# EAGLE design EC-TDS-PPM1_6 (EAGLE 7.5.0)
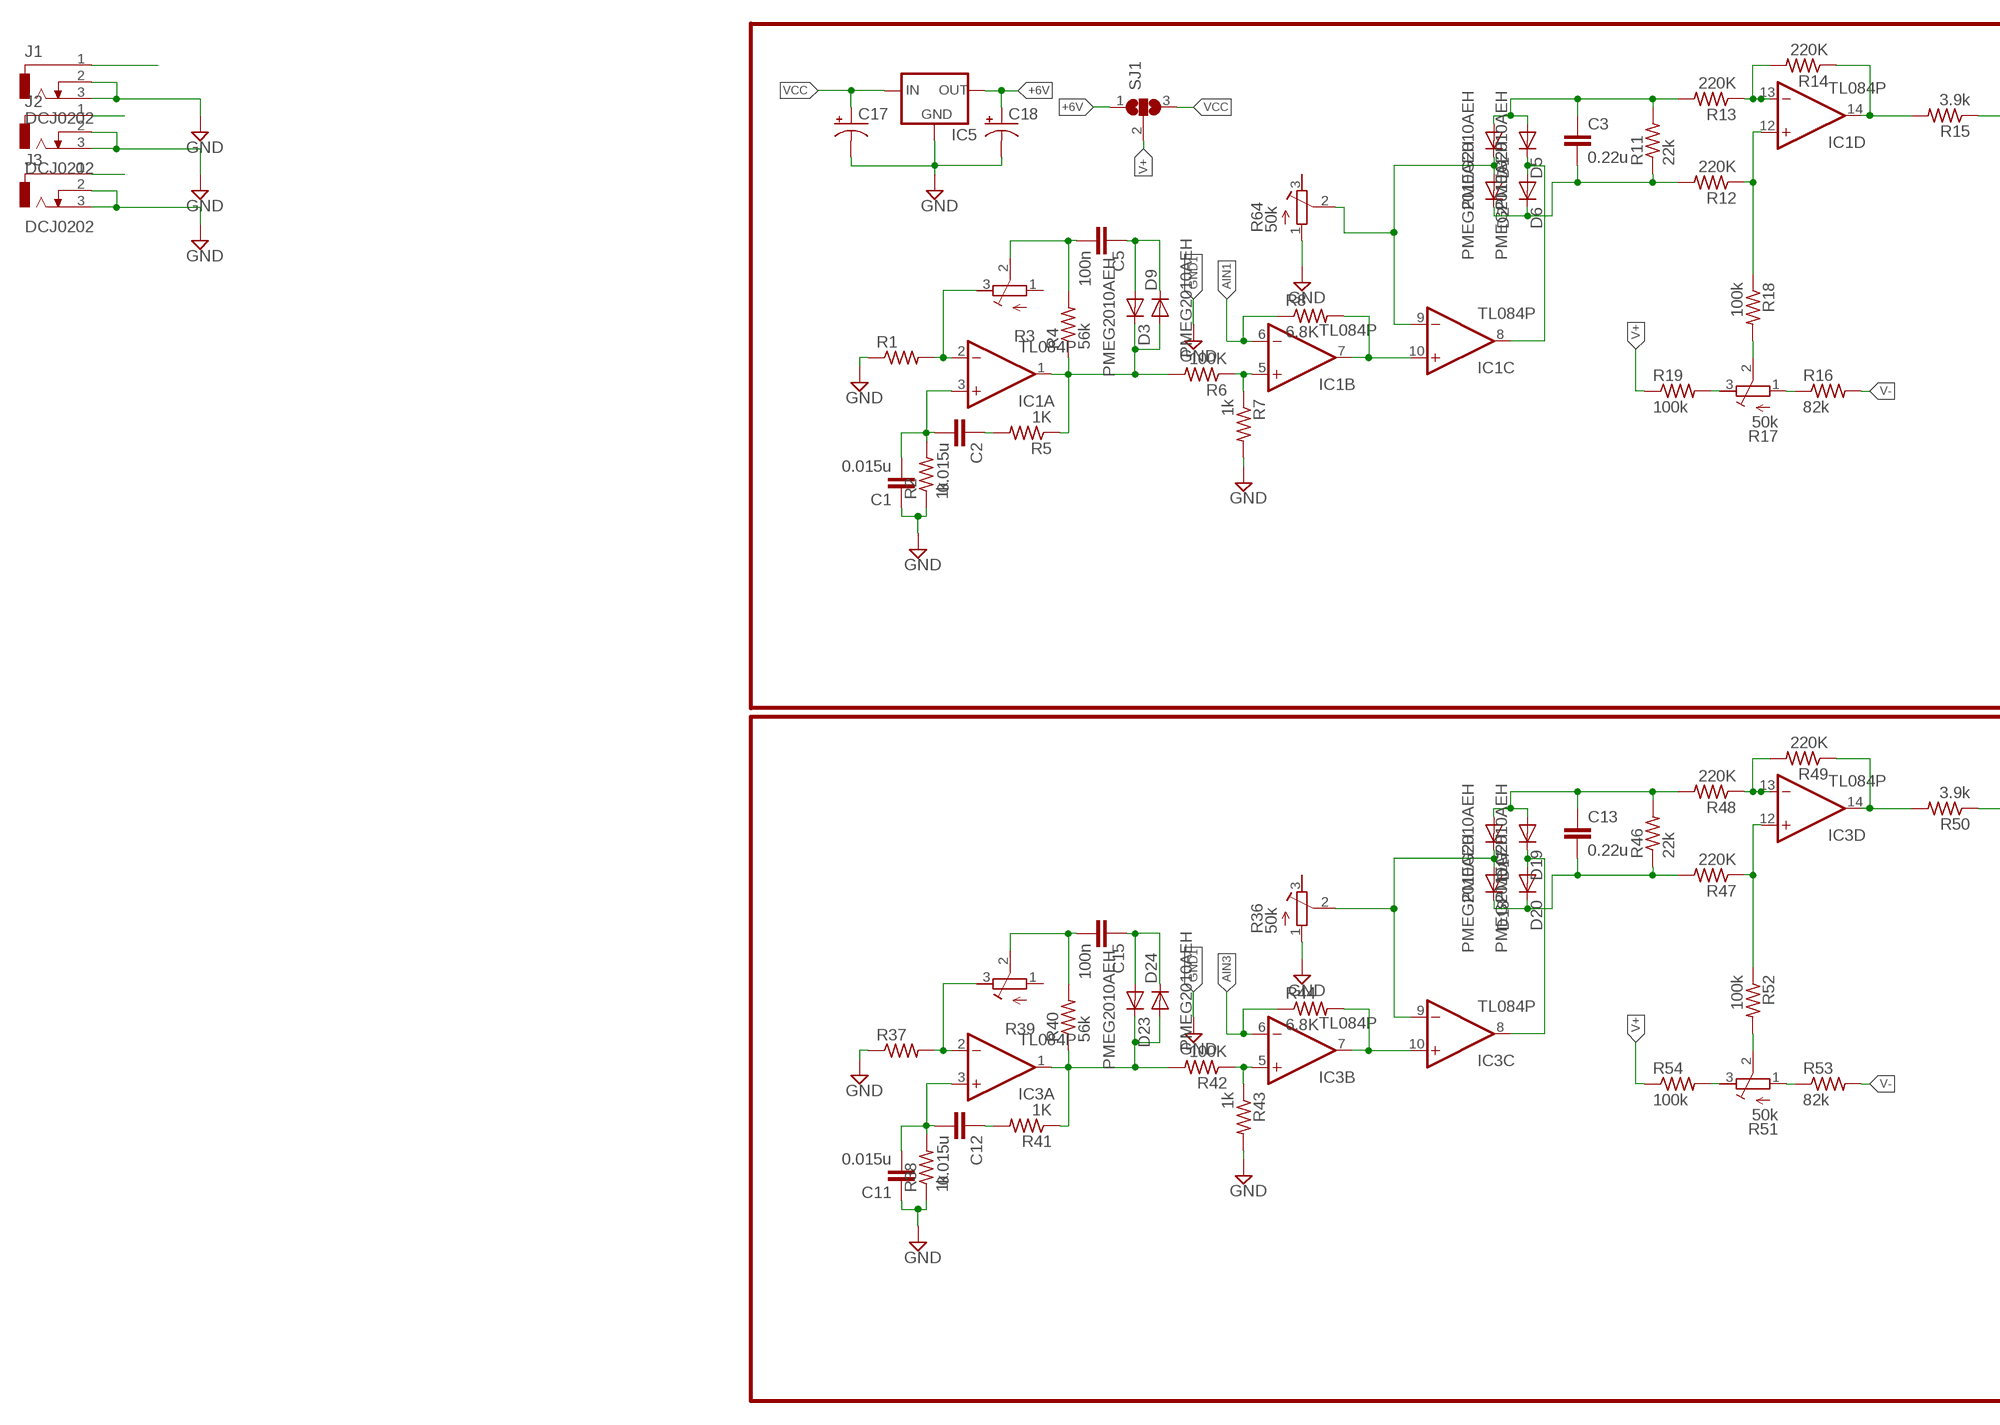
[diagram p0: schematic, sheet 1, part 1 of 2]
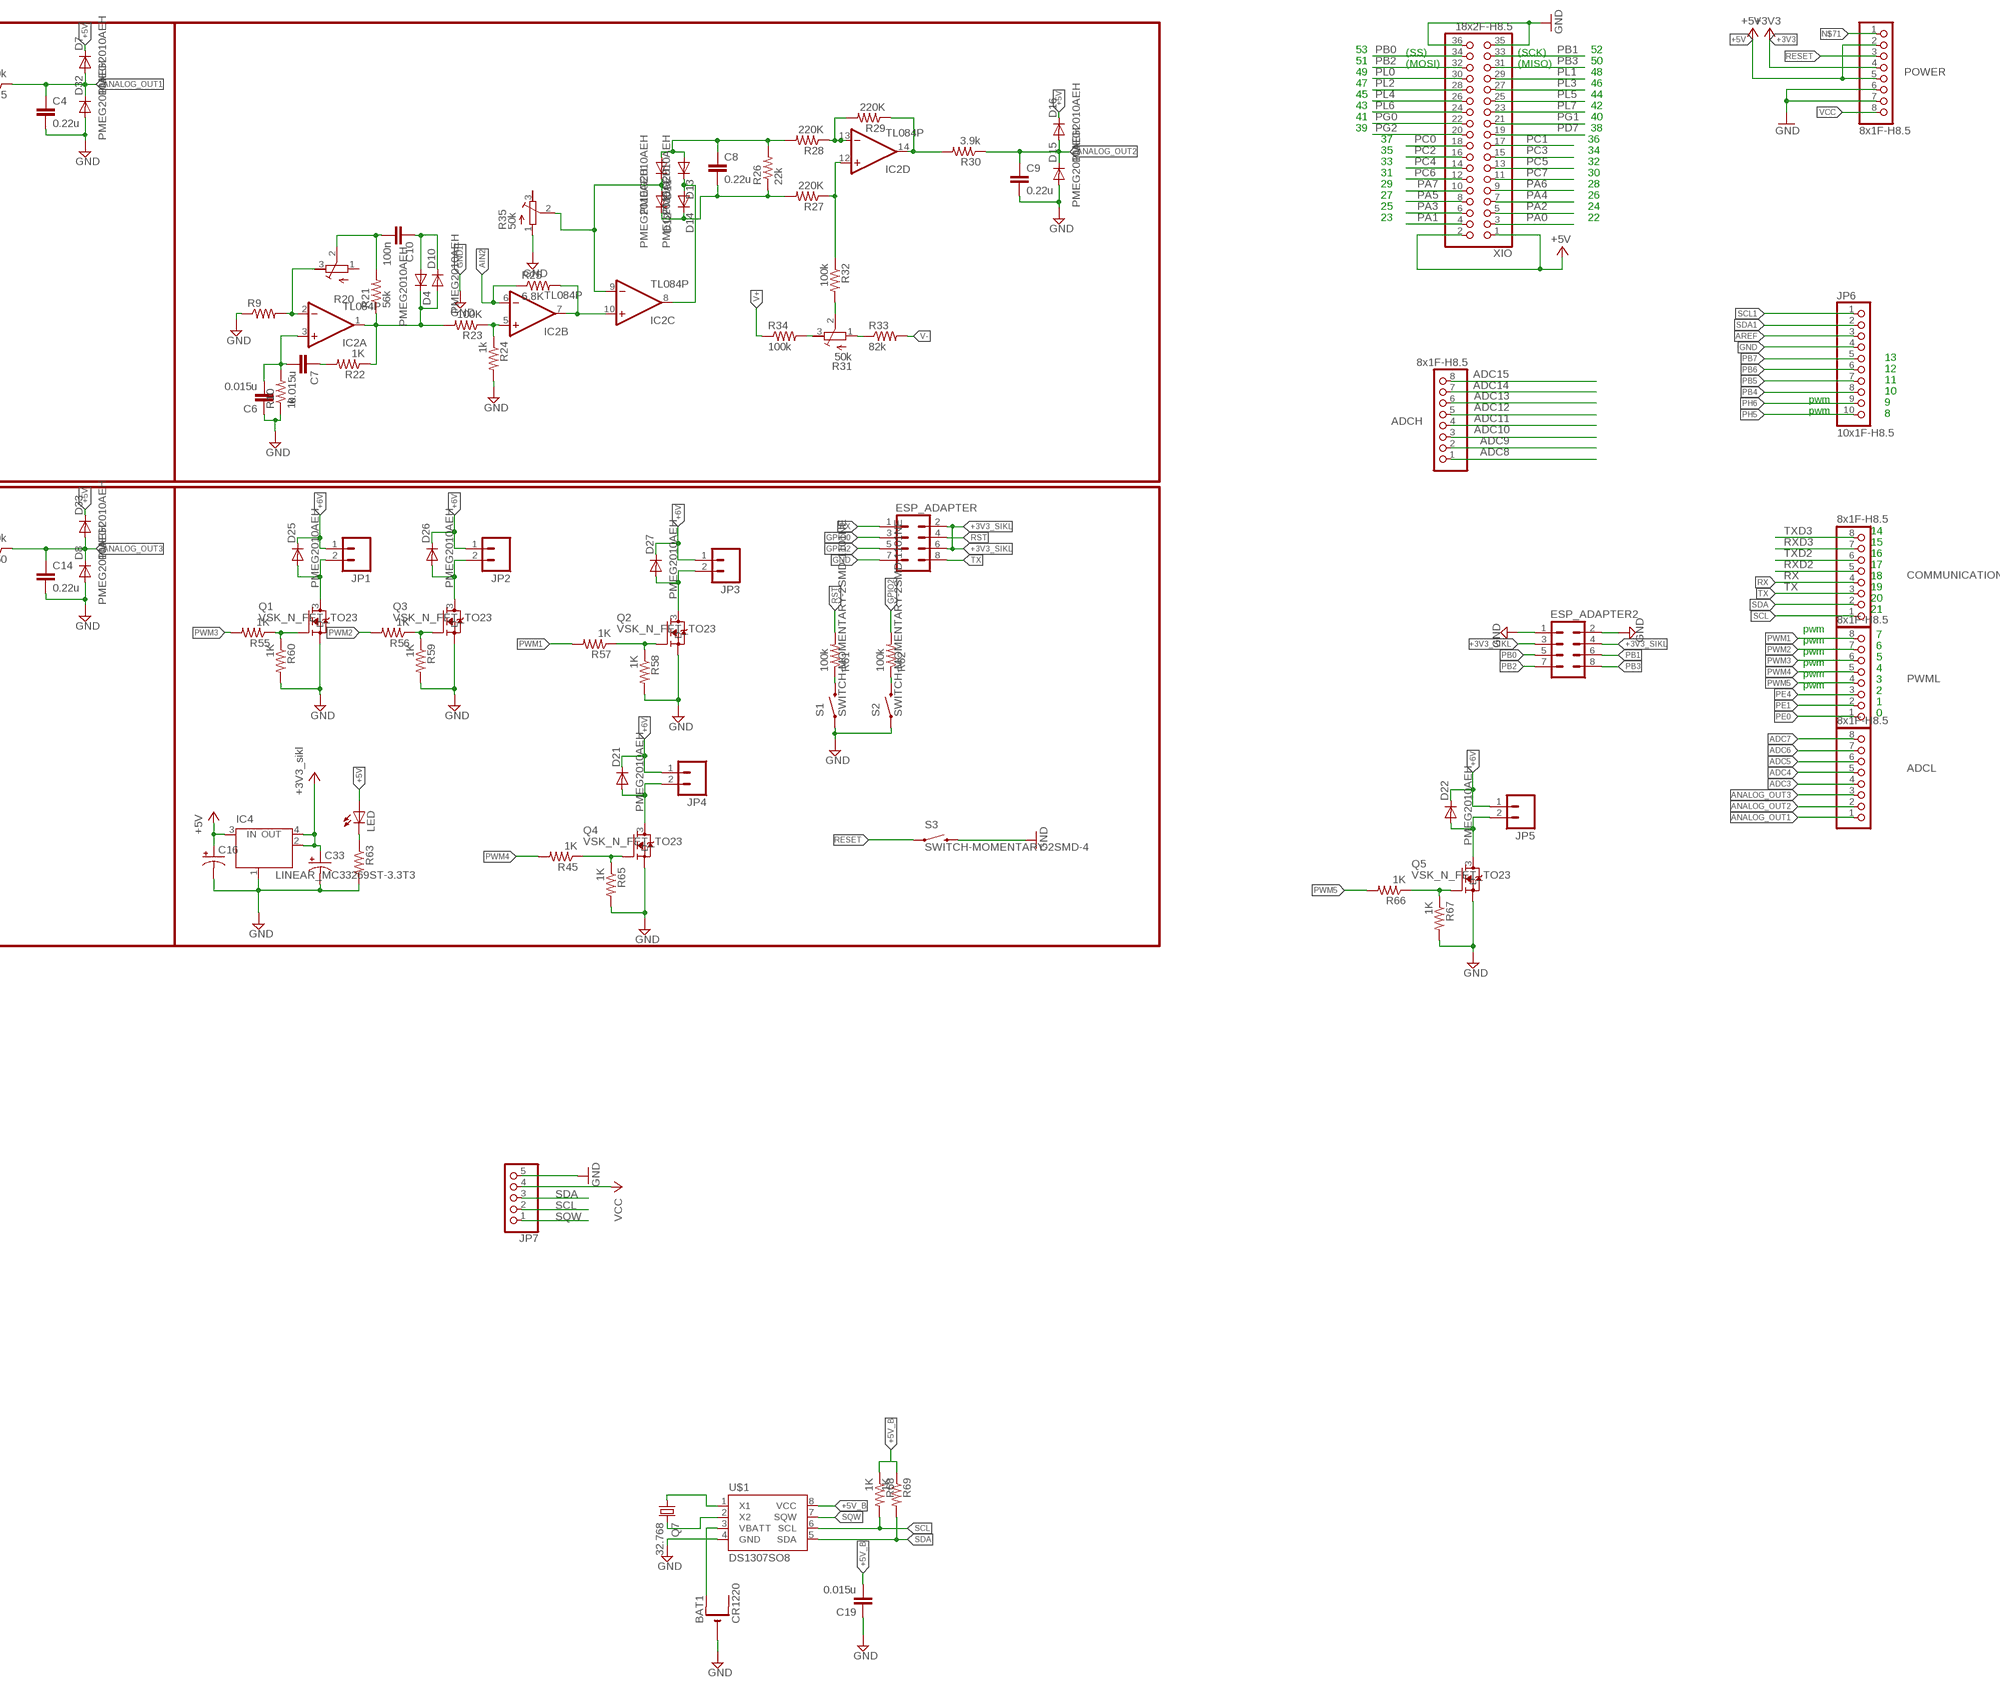
[diagram p1: schematic, sheet 1, part 2 of 2]

## Parts
ADCH  8x1F-H8.5  PINHD-1X8  [1X08]
ADCL  8x1F-H8.5  PINHD-1X8  [1X08]
BAT1  CR1220  CR1220THM  [CR1220-THM]
C1  0.015u  C-EUC0603  [C0603]
C2  0.015u  C-EUC0603  [C0603]
C3  0.22u  C-EUC0603  [C0603]
C4  0.22u  C-EUC0603  [C0603]
C5  100n  C-EUC0603  [C0603]
C6  0.015u  C-EUC0603  [C0603]
C7  0.015u  C-EUC0603  [C0603]
C8  0.22u  C-EUC0603  [C0603]
C9  0.22u  C-EUC0603  [C0603]
C10  100n  C-EUC0603  [C0603]
C11  0.015u  C-EUC0603  [C0603]
C12  0.015u  C-EUC0603  [C0603]
C13  0.22u  C-EUC0603  [C0603]
C14  0.22u  C-EUC0603  [C0603]
C15  100n  C-EUC0603  [C0603]
C16  CPOL-USSMCC  [SMC_C]
C17  CPOL-USSMCC  [SMC_C]
C18  CPOL-USSMCC  [SMC_C]
C19  0.015u  C-EUC0603  [C0603]
C33  CPOL-USSMCC  [SMC_C]
COMMUNICATION  8x1F-H8.5  PINHD-1X8  [1X08]
D1  PMEG2010AEH  DIOD_SOT123F  [SOT123F]
D2  PMEG2010AEH  DIOD_SOT123F  [SOT123F]
D3  PMEG2010AEH  DIOD_SOT123F  [SOT123F]
D4  PMEG2010AEH  DIOD_SOT123F  [SOT123F]
D5  PMEG2010AEH  DIOD_SOT123F  [SOT123F]
D6  PMEG2010AEH  DIOD_SOT123F  [SOT123F]
D7  PMEG2010AEH  DIOD_SOT123F  [SOT123F]
D8  PMEG2010AEH  DIOD_SOT123F  [SOT123F]
D9  PMEG2010AEH  DIOD_SOT123F  [SOT123F]
D10  PMEG2010AEH  DIOD_SOT123F  [SOT123F]
D11  PMEG2010AEH  DIOD_SOT123F  [SOT123F]
D12  PMEG2010AEH  DIOD_SOT123F  [SOT123F]
D13  PMEG2010AEH  DIOD_SOT123F  [SOT123F]
D14  PMEG2010AEH  DIOD_SOT123F  [SOT123F]
D15  PMEG2010AEH  DIOD_SOT123F  [SOT123F]
D16  PMEG2010AEH  DIOD_SOT123F  [SOT123F]
D17  PMEG2010AEH  DIOD_SOT123F  [SOT123F]
D18  PMEG2010AEH  DIOD_SOT123F  [SOT123F]
D19  PMEG2010AEH  DIOD_SOT123F  [SOT123F]
D20  PMEG2010AEH  DIOD_SOT123F  [SOT123F]
D21  PMEG2010AEH  DIOD_SOT123F  [SOT123F]
D22  PMEG2010AEH  DIOD_SOT123F  [SOT123F]
D23  PMEG2010AEH  DIOD_SOT123F  [SOT123F]
D24  PMEG2010AEH  DIOD_SOT123F  [SOT123F]
D25  PMEG2010AEH  DIOD_SOT123F  [SOT123F]
D26  PMEG2010AEH  DIOD_SOT123F  [SOT123F]
D27  PMEG2010AEH  DIOD_SOT123F  [SOT123F]
D32  PMEG2010AEH  DIOD_SOT123F  [SOT123F]
D33  PMEG2010AEH  DIOD_SOT123F  [SOT123F]
ESP_ADAPTER  M04X2  [2X4]
ESP_ADAPTER2  M04X2  [2X4]
IC1  TL084P  [DIL14]
IC2  TL084P  [DIL14]
IC3  TL084P  [DIL14]
IC4  LINEAR_MC33269ST-3.3T3  [LINEAR_SOT223]
IC5  78XXS  [78XXS]
J1  DCJ0202  [DCJ0202]
J2  DCJ0202  [DCJ0202]
J3  DCJ0202  [DCJ0202]
JP1  M02PTH  [1X02]
JP2  M02PTH  [1X02]
JP3  M02PTH  [1X02]
JP4  M02PTH  [1X02]
JP5  M02PTH  [1X02]
JP6  10x1F-H8.5  PINHD-1X10_ARD  [1X10]
JP7  PINHD-1X5  [1X05]
LED  SPARKFUN_LED0603  [SPARKFUN_LED-0603]
POWER  8x1F-H8.5  PINHD-1X8  [1X08]
PWML  8x1F-H8.5  PINHD-1X8  [1X08]
Q1  VSK_N_FET_TO23  [SOT23]
Q2  VSK_N_FET_TO23  [SOT23]
Q3  VSK_N_FET_TO23  [SOT23]
Q4  VSK_N_FET_TO23  [SOT23]
Q5  VSK_N_FET_TO23  [SOT23]
Q7  32.768  CRYTALTC38H  [TC38H]
R1  R-US_R0603  [R0603]
R2  1k  R-US_R0603  [R0603]
R3  R-TRIMM64W  [RTRIM64W]
R4  56k  R-US_R0603  [R0603]
R5  1K  R-US_R0603  [R0603]
R6  100K  R-US_R0603  [R0603]
R7  1k  R-US_R0603  [R0603]
R8  6.8K  R-US_R0603  [R0603]
R9  R-US_R0603  [R0603]
R10  1k  R-US_R0603  [R0603]
R11  22k  R-US_R0603  [R0603]
R12  220K  R-US_R0603  [R0603]
R13  220K  R-US_R0603  [R0603]
R14  220K  R-US_R0603  [R0603]
R15  3.9k  R-US_R0603  [R0603]
R16  82k  R-US_R0603  [R0603]
R17  50k  R-TRIMM64W  [RTRIM64W]
R18  100k  R-US_R0603  [R0603]
R19  100k  R-US_R0603  [R0603]
R20  R-TRIMM64W  [RTRIM64W]
R21  56k  R-US_R0603  [R0603]
R22  1K  R-US_R0603  [R0603]
R23  100K  R-US_R0603  [R0603]
R24  1k  R-US_R0603  [R0603]
R25  6.8K  R-US_R0603  [R0603]
R26  22k  R-US_R0603  [R0603]
R27  220K  R-US_R0603  [R0603]
R28  220K  R-US_R0603  [R0603]
R29  220K  R-US_R0603  [R0603]
R30  3.9k  R-US_R0603  [R0603]
R31  50k  R-TRIMM64W  [RTRIM64W]
R32  100k  R-US_R0603  [R0603]
R33  82k  R-US_R0603  [R0603]
R34  100k  R-US_R0603  [R0603]
R35  50k  R-TRIMM64W  [RTRIM64W]
R36  50k  R-TRIMM64W  [RTRIM64W]
R37  R-US_R0603  [R0603]
R38  1k  R-US_R0603  [R0603]
R39  R-TRIMM64W  [RTRIM64W]
R40  56k  R-US_R0603  [R0603]
R41  1K  R-US_R0603  [R0603]
R42  100K  R-US_R0603  [R0603]
R43  1k  R-US_R0603  [R0603]
R44  6.8K  R-US_R0603  [R0603]
R45  1K  R-US_R0603  [R0603]
R46  22k  R-US_R0603  [R0603]
R47  220K  R-US_R0603  [R0603]
R48  220K  R-US_R0603  [R0603]
R49  220K  R-US_R0603  [R0603]
R50  3.9k  R-US_R0603  [R0603]
R51  50k  R-TRIMM64W  [RTRIM64W]
R52  100k  R-US_R0603  [R0603]
R53  82k  R-US_R0603  [R0603]
R54  100k  R-US_R0603  [R0603]
R55  1K  R-US_R0603  [R0603]
R56  1K  R-US_R0603  [R0603]
R57  1K  R-US_R0603  [R0603]
R58  1K  R-US_R0603  [R0603]
R59  1K  R-US_R0603  [R0603]
R60  1K  R-US_R0603  [R0603]
R61  100k  R-US_R0603  [R0603]
R62  100k  R-US_R0603  [R0603]
R63  SPARKFUN_RESISTOR0603-RES  [SPARKFUN_0603-RES]
R64  50k  R-TRIMM64W  [RTRIM64W]
R65  1K  R-US_R0603  [R0603]
R66  1K  R-US_R0603  [R0603]
R67  1K  R-US_R0603  [R0603]
R68  1K  R-US_R0603  [R0603]
R69  1K  R-US_R0603  [R0603]
S1  SWITCH-MOMENTARY-2SMD-1101NE  [TACTILE-SWITCH-1101NE]
S2  SWITCH-MOMENTARY-2SMD-1101NE  [TACTILE-SWITCH-1101NE]
S3  SWITCH-MOMENTARY-2SMD-4  [TACTILE_SWITCH_TALL]
SJ1  SJ2WW  [SJ_2W]
U$1  DS1307SO8  [SO08]
XIO  18x2F-H8.5  PINHD-2X18  [2X18]

## Nets
+3V3: POWER.4
+3V3_SIKL: C33.+ ESP_ADAPTER2.3 ESP_ADAPTER2.4 ESP_ADAPTER.2 ESP_ADAPTER.6 IC4.2(OUT) IC4.4(OUT) ; supply symbol labelled +3V3_sikl
+5V: C16.+ D7.C D16.C D33.C IC4.3(IN) LED.A POWER.2 POWER.5
+5V_B: C19.2 JP7.4 R68.1 R69.1 U$1.8(VCC) XIO.1 XIO.2 ; supply symbol labelled VCC, +5V
+6V: C18.+ D21.C D22.C D25.C D26.C D27.C IC5.OUT JP1.1 JP2.1 JP3.1 JP4.1 JP5.1 SJ1.1
ADC3: ADCL.4
ADC4: ADCL.5
ADC5: ADCL.6
ADC6: ADCL.7
ADC7: ADCL.8
ADC8: ADCH.1
ADC9: ADCH.2
ADC10: ADCH.3
ADC11: ADCH.4
ADC12: ADCH.5
ADC13: ADCH.6
ADC14: ADCH.7
ADC15: ADCH.8
AIN1: IC1.6(B:-IN) J1.1 R8.1
AIN2: IC2.6(B:-IN) J2.1 R25.1
AIN3: IC3.6(B:-IN) J3.1 R44.1
ANALOG_OUT1: ADCL.1 C4.1 D7.A D32.C R15.1
ANALOG_OUT2: ADCL.2 C9.1 D15.C D16.A R30.1
ANALOG_OUT3: ADCL.3 C14.1 D8.C D33.A R50.1
AREF: JP6.3
GND: ESP_ADAPTER.7 JP6.4 JP7.5 POWER.6 POWER.7 XIO.35 XIO.36
GND1: BAT1.- C1.1 C4.2 C6.1 C9.2 C11.1 C14.2 C16.- C17.- C18.- C19.1 C33.- D8.A D15.A D32.A ESP_ADAPTER2.1 ESP_ADAPTER2.2 IC4.1(GND/ADJ) IC5.GND J1.2 J1.3 J2.2 J2.3 J3.2 J3.3 Q1.2(S) Q2.2(S) Q3.2(S) Q4.2(S) Q5.2(S) R1.1 R2.1 R7.2 R9.1 R10.1 R24.2 R35.1(A) R36.1(A) R37.1 R38.1 R43.2 R58.2 R59.2 R60.2 R63.2 R64.1(A) R65.2 R67.2 S1.1 S2.1 S3.B2 U$1.4(GND) ; supply symbol labelled GND
GPIO0: ESP_ADAPTER.3
GPIO2: ESP_ADAPTER.5 R62.2
N$1: IC1.2(A:-IN) R1.2 R3.3(E)
N$2: C2.1 R5.2
N$3: C1.2 C2.2 IC1.3(A:+IN) R2.2
N$4: IC1.5(B:+IN) R6.1 R7.1
N$5: C5.2 R3.2(S) R4.2
N$6: R16.1 R17.1(A)
N$7: D3.C D9.A IC1.1(A:OUT) R4.1 R5.1 R6.2
N$8: C5.1 D3.A D9.C
N$9: IC1.7(B:OUT) IC1.10(C:+IN) R8.2
N$10: R17.3(E) R19.2
N$11: IC1.13(D:-IN) R13.1 R14.2
N$12: C3.1 D1.A D5.A R11.2 R13.2
N$13: D1.C D2.A IC1.9(C:-IN) R64.2(S)
N$14: C3.2 D2.C D6.C R11.1 R12.2
N$15: D5.C D6.A IC1.8(C:OUT)
N$16: IC1.12(D:+IN) R12.1 R18.1
N$17: IC1.14(D:OUT) R14.1 R15.2
N$18: R17.2(S) R18.2
N$19: IC2.2(A:-IN) R9.2 R20.3(E)
N$20: C6.2 C7.2 IC2.3(A:+IN) R10.2
N$21: C10.2 R20.2(S) R21.2
N$22: D4.C D10.A IC2.1(A:OUT) R21.1 R22.1 R23.2
N$23: C7.1 R22.2
N$24: IC2.5(B:+IN) R23.1 R24.1
N$25: IC2.7(B:OUT) IC2.10(C:+IN) R25.2
N$26: C8.1 D11.A D13.A R26.2 R28.2
N$27: D11.C D12.A IC2.9(C:-IN) R35.2(S)
N$28: C8.2 D12.C D14.C R26.1 R27.2
N$29: D13.C D14.A IC2.8(C:OUT)
N$30: IC2.13(D:-IN) R28.1 R29.2
N$31: IC2.12(D:+IN) R27.1 R32.1
N$32: IC2.14(D:OUT) R29.1 R30.2
N$33: C10.1 D4.A D10.C
N$34: R31.1(A) R33.1
N$35: R31.3(E) R34.2
N$36: R31.2(S) R32.2
N$37: IC3.2(A:-IN) R37.2 R39.3(E)
N$38: C11.2 C12.2 IC3.3(A:+IN) R38.2
N$39: C15.2 R39.2(S) R40.2
N$40: D23.C D24.A IC3.1(A:OUT) R40.1 R41.1 R42.2
N$41: C12.1 R41.2
N$42: IC3.5(B:+IN) R42.1 R43.1
N$43: IC3.7(B:OUT) IC3.10(C:+IN) R44.2
N$44: C13.1 D17.A D19.A R46.2 R48.2
N$45: D17.C D18.A IC3.9(C:-IN) R36.2(S)
N$46: C13.2 D18.C D20.C R46.1 R47.2
N$47: D19.C D20.A IC3.8(C:OUT)
N$48: IC3.13(D:-IN) R48.1 R49.2
N$49: IC3.12(D:+IN) R47.1 R52.1
N$50: IC3.14(D:OUT) R49.1 R50.2
N$51: C15.1 D23.A D24.C
N$52: R51.1(A) R53.1
N$53: R51.3(E) R54.2
N$54: R51.2(S) R52.2
N$55: D26.A JP2.2 Q3.3(D)
N$56: D27.A JP3.2 Q2.3(D)
N$57: D25.A JP1.2 Q1.3(D)
N$58: Q2.1(G) R57.1 R58.1
N$59: Q3.1(G) R56.1 R59.1
N$60: D21.A JP4.2 Q4.3(D)
N$61: Q1.1(G) R55.1 R60.1
N$62: R61.1 S1.2
N$63: R62.1 S2.2
N$64: LED.C R63.1
N$65: Q4.1(G) R45.1 R65.1
N$66: D22.A JP5.2 Q5.3(D)
N$67: Q5.1(G) R66.1 R67.1
N$68: Q7.1 U$1.1(X1)
N$69: Q7.2 U$1.2(X2)
N$71: POWER.1
N$72: BAT1.+1(+) U$1.3(VBATT)
PA0: XIO.3
PA1: XIO.4
PA2: XIO.5
PA3: XIO.6
PA4: XIO.7
PA5: XIO.8
PA6: XIO.9
PA7: XIO.10
PB0: ESP_ADAPTER2.5 XIO.34
PB1: ESP_ADAPTER2.6 XIO.33
PB2: ESP_ADAPTER2.7 XIO.32
PB3: ESP_ADAPTER2.8 XIO.31
PB4: JP6.8
PB5: JP6.7
PB6: JP6.6
PB7: JP6.5
PC0: XIO.18
PC1: XIO.17
PC2: XIO.16
PC3: XIO.15
PC4: XIO.14
PC5: XIO.13
PC6: XIO.12
PC7: XIO.11
PD7: XIO.19
PE0: PWML.1
PE1: PWML.2
PE4: PWML.3
PG0: XIO.22
PG1: XIO.21
PG2: XIO.20
PH5: JP6.10
PH6: JP6.9
PL0: XIO.30
PL1: XIO.29
PL2: XIO.28
PL3: XIO.27
PL4: XIO.26
PL5: XIO.25
PL6: XIO.24
PL7: XIO.23
PWM1: PWML.8 R57.2
PWM2: PWML.7 R56.2
PWM3: PWML.6 R55.2
PWM4: PWML.5 R45.2
PWM5: PWML.4 R66.2
RESET: POWER.3 S3.A2
RST: ESP_ADAPTER.4 R61.2
RX: COMMUNICATION.4 ESP_ADAPTER.1
RXD2: COMMUNICATION.5
RXD3: COMMUNICATION.7
SCL: COMMUNICATION.1 JP7.2 R68.2 U$1.6(SCL)
SCL1: JP6.1
SDA: COMMUNICATION.2 JP7.3 R69.2 U$1.5(SDA)
SDA1: JP6.2
SQW: JP7.1 U$1.7(SQW)
TX: COMMUNICATION.3 ESP_ADAPTER.8
TXD2: COMMUNICATION.6
TXD3: COMMUNICATION.8
V+: R19.1 R34.1 R54.1 SJ1.2
V-: R16.2 R33.2 R53.2
VCC [power]: C17.+ IC5.IN POWER.8 SJ1.3
Unconnected: BAT1.+2(+1) R3.1(A) R20.1(A) R35.3(E) R36.3(E) R39.1(A) R64.3(E)

## Notes on the sheet
- 53 | (SS) | (SCK) | 52
- 51 | (MOSI) | (MISO) | 50
- 49 | 48
- 47 | 46
- 45 | 44
- 43 | 42
- 41 | 40
- 39 | 38
- 37 | 36
- 35 | 34
- 33 | 32
- 31 | 30
- 29 | 28
- 27 | 26
- 25 | 24
- 23 | 22
- 13
- 12
- 11
- 10
- pwm | 9
- pwm | 8
- 14
- 15
- 16
- 17
- 18
- 19
- 20
- 21
- pwm
- 7
- pwm
- 6
- pwm
- 5
- pwm
- 4
- pwm
- 3
- pwm
- 2
- 1
- 0

## Power pins joined to a net without a drawn wire
V+: IC1.4(P:V+) IC2.4(P:V+) IC3.4(P:V+)
V-: IC1.11(P:V-) IC2.11(P:V-) IC3.11(P:V-)

## Library data of the parts
ADCH ADCL COMMUNICATION POWER PWML = SmartPrj:PINHD-1X8: PIN HEADER
BAT1 = adafruit:CR1220: CR1216/CR1220/CR1225 12mm 3V lithium coin cell Great for battery packup. Both SMT and THM holders. Note the THM package has the ground pads on both sides of the PCB so that the masks are the same - this reduces the cost
C1-C15 C19 = resistor:C-EU: CAPACITOR, European symbol
C16-C18 C33 = rcl:CPOL-US: POLARIZED CAPACITOR, American symbol
D1-D27 D32 D33 = Enleka_Diode:DIOD_SOT123F; PARTNO: PMEG2010AEH,115
ESP_ADAPTER ESP_ADAPTER2 = SparkFun-Connectors:M04X2: .1" header, two rows of four.
IC1-IC3 = linear:TL084: OP AMP
IC4 = Robotech_Other:LINEAR_MC33269ST*: Adjustable Output Low Dropout Voltage Regulator 800 mA Source: http://www.onsemi.com/pub/Collateral/MC33269-D.PDF
IC5 = v-reg:78XXS: VOLTAGE REGULATOR
J1-J3 = con-jack:DCJ0202: DC POWER JACK Source: DCJ0202.pdf; OC_FARNELL: unknown; OC_NEWARK: unknown
JP1-JP5 = SparkFun-Connectors:M02: Standard 2-pin 0.1" header. Use with - straight break away headers ( PRT-00116) - right angle break away headers (PRT-00553) - swiss pins (PRT-00743) - machine pins (PRT-00117) - female headers (PRT-00115) Molex polarized connector foot print use with: PRT-08233 with associated crimp pins and housings. 2.54_SCREWTERM for use with PRT-10571. 3.5mm Screw Terminal footprints for PRT-08084 5mm Screw Terminal footprints for use with PRT-08432
JP6 = SmartPrj:PINHD-1X10_ARD: PIN HEADER
JP7 = pinhead:PINHD-1X5: PIN HEADER
LED = Robotech RLC of Chung:SPARKFUN_LED: LEDs Standard schematic elements and footprints for 5mm, 3mm, 1206, and 0603 sized LEDs. 5mm - Spark Fun Electronics SKU : COM-00529 (and others)
Q1-Q5 = transistor-fet:VSK_N_FET_TO23
Q7 = crystal:CRYTAL: CRYSTAL
R1 R2 R4-R16 R18 R19 R21-R30 R32-R34 R37 R38 R40-R50 R52-R62 R65-R69 = resistor:R-US_: RESISTOR, American symbol
R3 R17 R20 R31 R35 R36 R39 R51 R64 = resistor:R-TRIMM: Trimm resistor
R63 = Robotech_RCL:SPARKFUN_RESISTOR: Resistor Basic schematic elements and footprints for 0603, 1206, and PTH resistors.
S1 S2 = SparkFun-Electromechanical:SWITCH-MOMENTARY-2: Various NO switches- pushbuttons, reed, etc; PROD_ID: SWCH-00815
S3 = SparkFun-Electromechanical:SWITCH-MOMENTARY-2: Various NO switches- pushbuttons, reed, etc; PROD_ID: SWCH-11966
SJ1 = jumper:SJ2W: SMD solder JUMPER
U$1 = SparkFun-FreqCtrl:DS1307: I2C real-time clock with battery backup.
XIO = SmartPrj:PINHD-2X18: PIN HEADER

## Net classes
1 power: width 0.61 mm, drill 0.406 mm, clearance 0.203 mm
2 gnd: width 0.305 mm, drill 0.406 mm, clearance 0.203 mm
3 power usb: width 0.508 mm, drill 0.406 mm, clearance 0.203 mm

## Board
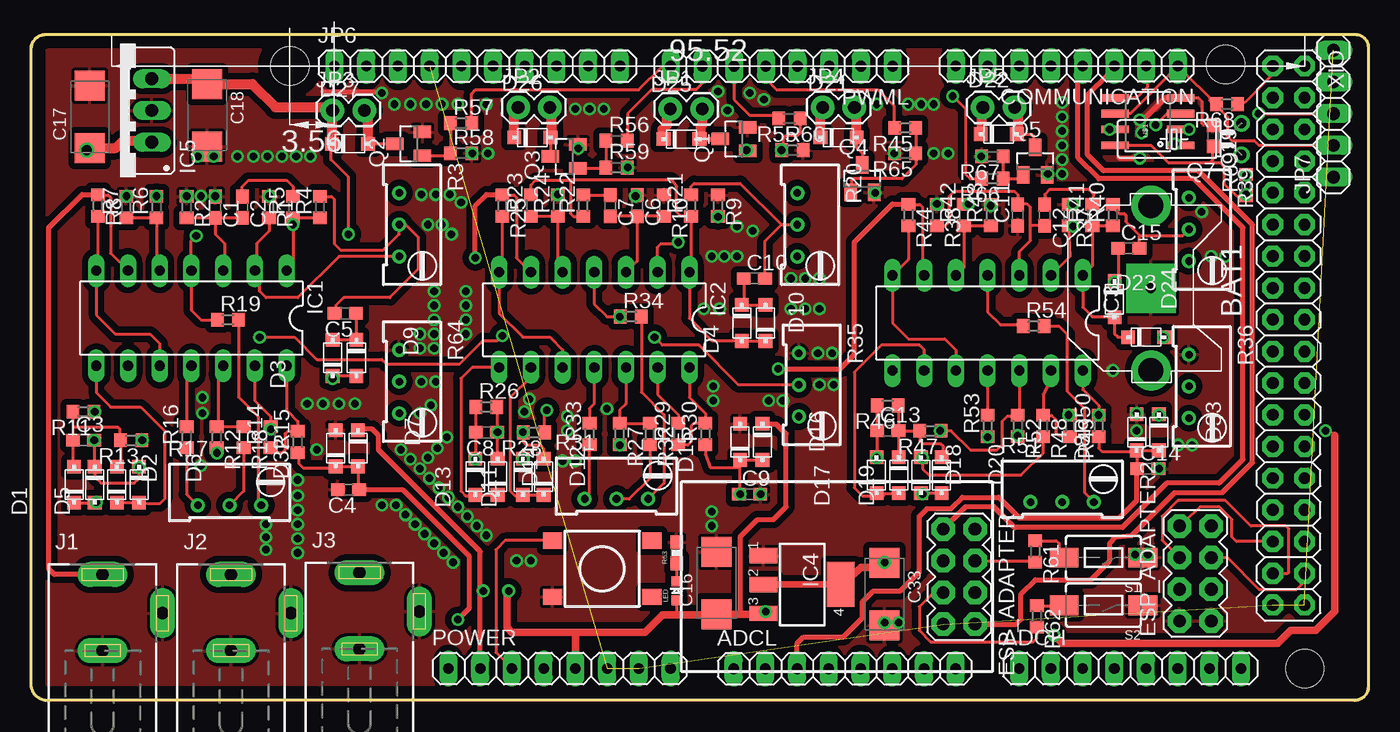
[diagram p2: board, top side]
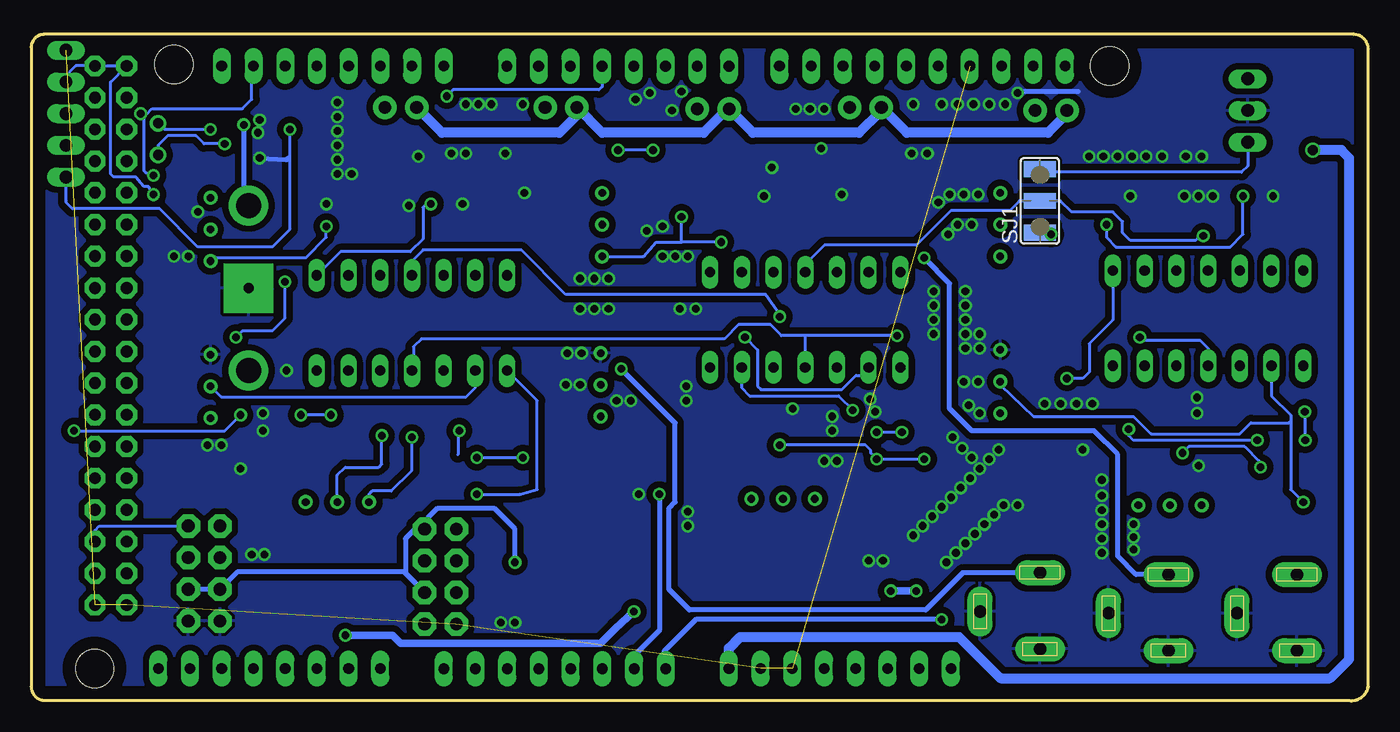
[diagram p3: board, bottom side, seen from below]

Size 107.06 x 53.35 mm. Coordinates in mm from the lower left corner, seen from the top.
Outline: 0,1.14 0,52.19 arc-90 1.17,53.35 106.04,53.35 arc-90 107.06,52.33 107.06,1.11 arc-90 105.97,0.01 1.51,0.01 arc-90 0,1.14
Copper layers (1*16): Top 0.035mm / dielectric 1.5mm / Bottom 0.035mm
Design rules "default *": minimum track width 10mil, minimum drill 24mil, track to track 10mil, track to pad 10mil, pad to pad 10mil, via to via 10mil, smd to smd 8mil, copper to edge 40mil, drill to drill 8mil, minimum pad ring 10mil, minimum via ring 8mil, stop-mask expansion 4mil, vias tented up to drill 100mil, thermal gap 10mil
Holes 3.05 mm at 20.7,50.82 101.98,2.56 95.63,50.94

### Footprints (pad centres in the part's own frame; a part is rotated, then mirrored left to right if it is on the bottom)
1X08 = drill 0.85 pad 1.422 long: 1 -8.89,0; 2 -6.35,0; 3 -3.81,0; 4 -1.27,0; 5 1.27,0; 6 3.81,0; 7 6.35,0; 8 8.89,0
CR1220-THM = drill 2 pad 3.175: +1 -6.604,0; +2 6.604,0 | drill 0.8 pad 3.962 square: - 0,0
C0603 = smd 1.1 x 1: 1 -0.85,0; 2 0.85,0
SMC_C = smd 2.4 x 2.4: + -2.5,0; - 2.5,0
SOT123F = smd 1.1 x 1.1: A 1.45,0; C -1.45,0
2X4 = drill 1.016 pad 1.88 octagon: 1 -3.81,-1.27; 2 -3.81,1.27; 3 -1.27,-1.27; 4 -1.27,1.27; 5 1.27,-1.27; 6 1.27,1.27; 7 3.81,-1.27; 8 3.81,1.27
DIL14 = drill 0.813 long: 1 -7.62,-3.81; 2 -5.08,-3.81; 3 -2.54,-3.81; 4 0,-3.81; 5 2.54,-3.81; 6 5.08,-3.81; 7 7.62,-3.81; 8 7.62,3.81; 9 5.08,3.81; 10 2.54,3.81; 11 0,3.81; 12 -2.54,3.81; 13 -5.08,3.81; 14 -7.62,3.81
LINEAR_SOT223 = smd 1.219 x 2.235: 1 -2.311,-3.099; 2 0,-3.099; 3 2.311,-3.099 | smd 3.6 x 2.2: 4 0,3.099
78XXS = drill 1.016 long: GND 0,-2.54; IN -2.54,-2.54; OUT 2.54,-2.54
DCJ0202 = drill 1 pad 2 long: 1 0,3.1; 2 4.8,0; 3 0,-3
1X02 = drill 1.016 pad 1.88: 1 0,0; 2 2.54,0
1X10 = drill 0.85 pad 1.422 long: 1 -11.43,0; 2 -8.89,0; 3 -6.35,0; 4 -3.81,0; 5 -1.27,0; 6 1.27,0; 7 3.81,0; 8 6.35,0; 9 8.89,0; 10 11.43,0
1X05 = drill 1.016 long: 1 -5.08,0; 2 -2.54,0; 3 0,0; 4 2.54,0; 5 5.08,0
SPARKFUN_LED-0603 = smd 0.8 x 0.8: A 0,-0.75; C 0,0.75
SOT23 = smd 1 x 1.4: 1 -0.95,-1.1; 2 0.95,-1.1; 3 0,1.1
TC38H = drill 0.813: 1 -1.27,0; 2 1.27,0
R0603 = smd 1 x 1.1: 1 -0.85,0; 2 0.85,0
RTRIM64W = drill 0.61: 1 1.27,-2.54; 2 1.27,0; 3 1.27,2.54
SPARKFUN_0603-RES = smd 1.1 x 1: 1 -0.85,0; 2 0.85,0
TACTILE-SWITCH-1101NE = smd 2.3 x 1.6: 1 -3.15,0; 2 3.15,0
TACTILE_SWITCH_TALL = smd 1.55 x 1.3: A1 -3.975,-2.25; A2 3.975,-2.25; B1 -3.975,2.25; B2 3.975,2.25
SJ_2W = smd 1.27 x 2.54: 1 -2.54,0; 2 0,0; 3 2.54,0
SO08 = smd 0.61 x 2.21: 1 -1.905,-2.616; 2 -0.635,-2.616; 3 0.635,-2.616; 4 1.905,-2.616; 5 1.905,2.616; 6 0.635,2.616; 7 -0.635,2.616; 8 -1.905,2.616
2X18 = drill 0.95 pad 1.676 octagon: 1 -21.59,-1.27; 2 -21.59,1.27; 3 -19.05,-1.27; 4 -19.05,1.27; 5 -16.51,-1.27; 6 -16.51,1.27; 7 -13.97,-1.27; 8 -13.97,1.27; 9 -11.43,-1.27; 10 -11.43,1.27; 11 -8.89,-1.27; 12 -8.89,1.27; 13 -6.35,-1.27; 14 -6.35,1.27; 15 -3.81,-1.27; 16 -3.81,1.27; 17 -1.27,-1.27; 18 -1.27,1.27; 19 1.27,-1.27; 20 1.27,1.27; 21 3.81,-1.27; 22 3.81,1.27; 23 6.35,-1.27; 24 6.35,1.27; 25 8.89,-1.27; 26 8.89,1.27; 27 11.43,-1.27; 28 11.43,1.27; 29 13.97,-1.27; 30 13.97,1.27; 31 16.51,-1.27; 32 16.51,1.27; 33 19.05,-1.27; 34 19.05,1.27; 35 21.59,-1.27; 36 21.59,1.27

### Placement (x,y rotation side)
ADCH  88,2.57 0 top
ADCL  65.14,2.54 0 top
BAT1  89.66,33.04 270 top
C1  14.73,39.51 270 top
C2  16.89,39.51 270 top
C3  4.19,20.85 0 top
C4  25.4,16.91 180 top
C5  25.15,31.01 180 top
C6  48.51,39.64 270 top
C7  46.35,39.64 270 top
C8  36.45,21.48 180 top
C9  57.53,16.53 0 top
C10  57.91,33.8 0 top
C11  78.99,38.88 90 top
C12  81.15,38.88 270 top
C13  68.58,21.61 0 top
C14  89.41,18.56 0 top
C15  87.88,36.21 0 top
C16  54.86,9.42 90 top
C17  4.7,46.75 90 top
C18  14.1,46.88 270 top
C19  94.62,45.23 270 top
C33  68.33,8.53 270 top
COMMUNICATION  82.92,50.83 180 top
D1  3.43,17.29 90 top
D2  5.08,17.29 270 top
D3  24.13,27.45 90 top
D4  58.8,30.24 90 top
D5  6.86,17.29 90 top
D6  8.64,17.29 270 top
D7  26.16,20.21 270 top
D8  88.52,21.48 90 top
D9  26.04,27.45 270 top
D10  56.9,30.24 270 top
D11  41.02,17.92 90 top
D12  39.37,17.92 270 top
D13  37.34,17.92 90 top
D14  35.56,17.92 270 top
D15  56.77,20.72 90 top
D16  58.55,20.72 270 top
D17  67.69,18.05 90 top
D18  69.47,18.05 270 top
D19  71.25,18.05 90 top
D20  72.9,18.05 270 top
D21  64.64,45.1 0 top
D22  77.47,45.36 0 top
D23  89.28,29.1 0 top
D24  86.74,32.15 270 top
D25  52.07,44.98 0 top
D26  40.13,45.1 0 top
D27  25.53,44.59 0 top
D32  24.38,20.21 90 top
D33  90.3,21.48 270 top
ESP_ADAPTER  74.3,9.92 270 top
ESP_ADAPTER2  93.22,10.18 90 top
IC1  12.83,30.62 180 top
IC2  45.09,30.5 180 top
IC3  76.58,30.24 180 top
IC4  61.72,9.29 270 top
IC5  7.11,47.26 90 top
J1  5.71,7 0 top
J2  16,7 0 top
J3  26.29,7.13 0 top
JP1  51.18,47.39 0 top
JP2  38.99,47.52 0 top
JP3  24.13,47.26 0 top
JP4  63.37,47.52 0 top
JP5  76.2,47.52 0 top
JP6  35.71,50.82 0 top
JP7  104.27,47.01 90 top
LED  51.69,8.78 0 top
POWER  42.3,2.57 0 top
PWML  60.08,50.8 180 top
Q1  56.26,44.98 90 top
Q2  30.23,44.59 90 top
Q3  42.67,43.58 90 top
Q4  66.55,41.8 0 top
Q5  80.39,43.2 0 top
Q7  96.9,44.98 90 top
R1  19.05,39.51 270 top
R2  12.45,39.51 270 top
R3  30.73,38.12 180 top
R4  23.11,39.51 90 top
R5  20.96,39.51 90 top
R6  10.03,39.51 90 top
R7  7.62,39.51 90 top
R8  5.33,39.64 270 top
R9  54.99,39.64 270 top
R10  50.67,39.64 270 top
R11  4.19,23.13 180 top
R12  14.86,21.1 270 top
R13  8,20.85 180 top
R14  19.18,21.1 90 top
R15  21.34,20.72 90 top
R16  12.45,21.1 90 top
R17  15.87,16.91 270 top
R18  17.02,21.1 270 top
R19  15.75,30.5 0 top
R20  62.61,38.12 180 top
R21  52.83,39.64 90 top
R22  44.2,39.64 90 top
R23  40,39.64 90 top
R24  42.16,39.64 90 top
R25  37.72,39.64 270 top
R26  36.45,23.51 0 top
R27  47.12,21.35 270 top
R28  40.26,21.48 180 top
R29  51.82,21.35 90 top
R30  53.97,21.35 90 top
R31  46.86,17.42 270 top
R32  49.53,21.35 270 top
R33  44.7,21.35 90 top
R34  48.01,30.75 0 top
R35  62.74,25.29 180 top
R36  93.98,25.16 180 top
R37  83.06,38.88 270 top
R38  72.52,38.88 270 top
R39  93.98,37.74 180 top
R40  86.61,38.88 90 top
R41  84.96,38.88 90 top
R42  74.68,38.88 90 top
R43  76.84,38.88 90 top
R44  70.23,38.88 270 top
R45  69.98,45.86 180 top
R46  68.58,23.64 180 top
R47  72.01,21.61 180 top
R48  81.03,21.99 270 top
R49  83.19,21.99 270 top
R50  85.47,21.99 90 top
R51  82.55,17.16 270 top
R52  78.99,21.99 270 top
R53  76.58,21.99 90 top
R54  80.26,29.99 0 top
R55  60.71,46.63 180 top
R56  46.86,44.85 0 top
R57  34.42,46.25 0 top
R58  34.42,43.83 0 top
R59  46.86,42.69 0 top
R60  60.96,44.09 0 top
R61  80.39,11.96 270 top
R62  80.52,6.75 270 top
R63  51.69,11.83 90 top
R64  30.73,25.54 180 top
R65  69.98,43.83 180 top
R66  76.96,41.8 180 top
R67  76.96,43.58 180 top
R68  95.76,47.77 180 top
R69  97.28,41.29 90 top
S1  85.85,11.45 180 top
S2  85.85,7.64 180 top
S3  45.72,10.56 180 top
SJ1  26.29,40.02 90 bottom
U$1  89.41,46.37 90 top
XIO  100.69,29.24 270 top

### Tracks (layer width: path | path; a pad name or v marks a point on that pad's centre or on a via)
+3V3_SIKL  (via drill 0.61)
  Top 0.381: v68.33,11.07 C33.+
  Top 0.508: IC4.2 IC4.4
  Top 0.61: IC4.4 65.58,9.85 66.42,10.69 68.24,10.69 C33.+
  Bottom 0.381: ESP_ADAPTER2.3 ESP_ADAPTER2.4 90.55,10.3 77.22,10.3 77.09,10.18 | v68.33,11.07 68.33,13.73 69.98,15.38 74.55,15.38 75.31,14.62 75.31,13.99 ESP_ADAPTER.2 76.33,13.73 77.09,12.97 77.09,10.18 | 77.09,10.18 ESP_ADAPTER.6
+5V  (via drill 0.61)
  Top 0.254: 104.39,21.23 104.01,21.61 v103.63,21.61 | v90.3,22.88 90.35,22.88 D33.C | LED.A 51.69,6.88
  Top 0.381: POWER.2 35.95,5.21 | 35.95,5.21 35.95,8.78 35.95,11.94 27.81,20.08 27.81,21.23 27.3,21.73 26.24,21.73 D7.C | C16.+ 55.37,6.92 | 56.77,6.92 56.77,13.1 58.17,14.5 59.44,14.5 60.45,15.51 60.45,21.35 59.69,22.12 58.6,22.12 D16.C | 35.95,5.21 35.94,5.48 | 58.94,7.04 58.89,7.04 v58.8,7.13
  Top 0.61: 43.57,5.48 POWER.5 43.57,3.05 | 43.57,5.48 49.15,5.48 50.55,6.88 51.69,6.88 55.33,6.88 55.37,6.92 56.77,6.92 57.91,6.92 | 57.91,6.92 58.94,7.04 IC4.3 | 58.04,7.04 57.91,6.92 | 104.39,21.23 104.39,7.13 102.87,5.61 100.84,5.61 99.82,4.59 82.55,4.59 v81.92,5.22 | 43.57,5.48 38.48,5.48 38.1,5.86 38.1,8.4 v38.23,8.78 | v36.2,8.78 35.95,8.78
  Bottom 0.254: v103.63,21.61 91.57,21.61 v90.3,22.88
  Bottom 0.61: v81.92,5.22 78.11,5.22 77.47,4.59 61.47,4.59 60.32,5.73 v58.8,7.13 | v38.23,8.78 v36.2,8.78
+5V_B  (via drill 0.61)
  Top 0.254: XIO.1 99.42,50.16 97.16,47.9 96.48,47.9 R68.1 | U$1.8 89.66,44.47 91.06,43.07 94.36,43.07 | 94.62,44.34 C19.2 94.62,43.32 94.36,43.07 | 94.36,43.07 95.25,43.07 95.5,42.82 95.5,41.42 96.52,40.4 97.24,40.4 R69.1 v97.28,40.53
  Bottom 0.254: v97.28,40.53 97.66,41.17 98.04,41.17 98.68,41.93 100.46,41.93 100.71,42.18 100.71,49.53 XIO.1 XIO.2 103.49,50.83 104.01,50.31 104.01,49.8 JP7.4
+6V  (via drill 0.61)
  Top 0.254: v25.4,37.36 25.4,41.93 24,43.32 24,45.66 D27.C
  Top 0.813: D21.C 63.19,47.72 JP4.1 | D27.C 24.08,47.72 JP3.1 23.88,47.52 19.56,47.52 17.69,49.38 C18.+ 13.68,49.8 IC5.OUT | D26.C 38.68,47.59 JP2.1 | 50.87,47.52 50.87,47.7 JP1.1 50.87,47.52 | 50.87,47.52 50.87,46.07 50.55,45.74 50.55,45.05 D25.C | JP5.1 76.07,47.39 76.07,45.41 D22.C
  Bottom 0.254: SJ1.1 25.65,37.48 v25.4,37.36
  Bottom 0.813: JP3.1 24.26,46.88 25.65,45.48 36.96,45.48 JP2.1 39.12,47.13 40.77,45.48 49.28,45.48 JP1.1 51.18,47.52 53.21,45.48 61.34,45.48 JP4.1 63.37,46.88 64.77,45.48 74.17,45.48 JP5.1
AIN1
  Top 0.254: R8.1 6.13,40.49 6.35,40.28 6.35,35.83 IC1.6
  Top 0.381: J1.1 1.85,10.1 1.4,10.56 1.4,37.86 4.06,40.53 5.29,40.53 R8.1
AIN2  (via drill 0.61)
  Top 0.254: R25.1 38.65,40.49 38.86,40.28 38.86,35.45 IC2.6
  Top 0.381: v35.56,35.45 35.56,39.64 36.45,40.53 37.68,40.53 R25.1
  Bottom 0.381: J2.1 18.59,10.1 20.07,11.57 20.07,19.7 21.97,21.61 31.75,21.61 33.53,23.39 33.53,33.42 v35.56,35.45
AIN3  (via drill 0.61)
  Top 0.254: R44.1 71.16,39.73 71.37,39.51 71.37,34.18 IC3.6
  Top 0.381: v59.82,26.56 64.77,26.56 65.91,27.7 65.91,36.72 68.96,39.77 70.19,39.77 R44.1
  Bottom 0.381: J3.1 32.46,10.23 35.43,7.26 54.36,7.26 56.01,8.91 56.01,15.38 55.5,15.89 55.5,22.24 v59.82,26.56
ANALOG_OUT1  (via drill 0.61)
  Top 0.254: R15.1 21.46,19.74 21.46,18.94 21.77,18.63 24.26,18.63 D32.C D7.A 26.16,17 C4.1 25.91,17.07
  Top 0.381: C4.1 29.72,16.91 35.05,11.57 35.05,7.38 v34.16,6.49
  Bottom 0.381: v34.16,6.49 53.85,6.49 56.39,3.95 56.39,2.68 ADCL.1
ANALOG_OUT2  (via drill 0.61)
  Top 0.254: R30.1 53.97,19.7 54.36,18.69 56.7,18.69 | 56.7,18.69 D15.C D16.A | 56.7,18.69 56.7,16.54 C9.1
  Top 0.381: 56.7,16.54 56.7,16.47 v56.77,16.53
  Bottom 0.381: v56.77,16.53 56.77,5.61 58.8,3.57 ADCL.2
ANALOG_OUT3
  Top 0.254: 88.32,19.83 D8.C | D8.C D33.A | D8.C 88.52,18.65 88.52,18.34 C14.1 | D8.C 88.45,19.96 85.73,19.96 85.47,20.21 R50.1
  Top 0.381: 88.52,18.65 C14.1 88.52,18.52 88.52,16.02 87.12,14.62 79.12,14.62 77.47,16.27 74.55,16.27 73.66,15.38 71.76,15.38 71.12,14.75 71.12,10.3 69.6,8.78 67.44,8.78 66.55,7.89 66.55,6.62 65.02,5.1 61.85,5.1 61.33,4.58 ADCL.3
GND  (6 unrouted)
GND1  (via drill 0.61)
  Top 0.254: U$1.4 93.47,48.28 93.73,48.02 93.73,46.25 93.85,46.12 | 94.58,46.12 C19.1
  Top 0.381: 23.37,48.79 27.94,48.79 v28.07,48.66 | U$1.4 90.81,48.28 89.03,46.5 89.03,45.61 v88.9,45.48 | 87.12,43.45 v88.77,43.45
  Bottom 0.381: 23.24,48.79 27.94,48.79 28.19,48.53 | v88.77,43.45 86.61,43.32 86.49,43.45
  other vias: 69.47,6.24 68.33,6.24 54.61,25.16 54.61,24.02 59.05,24.02 83.44,39.77 76.84,39.64 67.69,47.77 54.99,48.79 55.75,47.26 57.53,48.66 58.67,48.15 47.75,42.69 43.81,44.21 48.39,40.4 42.16,40.53 35.31,43.83 29.08,47.77 30.35,47.77 31.62,47.77 32.89,47.77 36.45,47.77 36.58,43.83 19.05,40.4 22.1,23.77 23.37,23.77 24.64,23.77 25.91,23.77 13.72,23 13.72,24.27 31.24,25.54 32.38,25.54 31.12,28.21 32.26,28.21 90.3,18.56 88.39,11.7 89.41,11.7 88.52,23 86.61,26.43 63.12,25.29 64.26,25.29 62.99,27.83 64.14,27.83 88.52,21.61 60.83,33.8 61.98,33.8 63.12,33.8 60.83,31.39 61.98,31.39 63.12,31.39 34.8,32.78 34.8,31.64 34.8,30.5 34.8,29.35 32.26,32.78 32.26,31.64 32.26,30.5 32.26,29.35 31.24,40.53 32.38,40.53 33.53,40.53 32.89,38.12 31.75,38.12 31.12,29.35 34.16,47.77 12.45,40.4 14.73,40.4 7.62,40.4 16.51,43.58 17.78,43.58 18.92,43.58 20.07,43.58 21.21,43.58 22.35,43.58 29.21,15.64 29.97,14.88 30.73,14.11 31.5,13.35 32.26,12.59 33.02,11.83 33.78,11.07 31.88,17.8 32.64,17.04 33.4,16.27 34.16,15.51 34.92,14.75 35.69,13.99 36.45,13.23 38.86,11.19 40,11.19 31.12,18.56 30.35,19.32 29.59,20.08 28.07,15.64 60.2,24.02 91.82,20.46 92.96,20.46 21.34,17.67 21.34,16.4 21.34,15.26 21.34,14.11 21.34,12.97 21.34,11.83 18.8,14.11 18.8,13.1 18.8,12.08 13.33,43.58 14.6,43.58 13.59,40.4 58.42,16.53 54.48,15.13 54.48,13.99 56.52,37.99 57.78,37.61 54.48,35.58 55.5,35.58 56.52,35.58 33.65,37.36 34.42,39.9 53.85,31.39 55.12,31.39 13.59,18.81 22.86,20.08 31.75,19.45 32.51,20.21 33.27,21.1 31.12,23 32,23.64 42.93,21.61 42.54,19.19 43.56,19.19 42.93,22.75 46.1,23.39 39.5,23.13 39.88,24.15 43.56,47.39 44.7,47.39 45.85,47.39 72.52,39.77 69.09,43.83 76.07,43.58 81.41,42.18 82.55,42.18 82.55,47.9 82.55,46.75 82.55,45.61 82.55,44.47 82.55,43.32 70.23,47.77 71.25,47.77 72.26,47.77 72.26,43.83 73.41,43.83 67.56,40.66 93.73,39.13 94.49,35.58 95.63,35.58 88.77,46.5
  pour Bottom (isolate 0.508): 0,53.36 0,0.02 107.06,0.02 107.06,53.36
  pour Top (isolate 0.508): 0,53.36 0,0.02 107.06,0.02 107.06,53.36
GPIO2
  Top 0.254: R62.2 80.52,4.97 80.26,4.72 72.01,4.72 71.12,5.61 71.12,7.51 72.26,8.65 ESP_ADAPTER.5
N$1
  Top 0.254: R1.2 19.05,37.61 18.03,36.59 18.03,34.56 IC1.2 18.29,34.05 18.29,32.78 18.8,32.28 21.34,32.28 24.64,35.58 R3.3
N$2
  Top 0.254: C2.1 16.89,41.17 17.4,41.67 20.45,41.67 20.96,41.17 R5.2
N$3
  Top 0.254: C1.2 14.73,37.36 15.49,36.59 15.49,34.56 IC1.3 | 16.64,38.63 16.68,38.66 C2.2 C1.2 | R2.2 C1.2
N$4
  Top 0.254: R7.1 R6.1 10.03,34.69 IC1.5
N$5
  Top 0.254: C5.2 24.38,31.09 24.38,31.64 25.02,32.28 28.7,32.28 30.99,34.56 30.99,37.1 29.97,38.12 R3.2 29.46,37.36 28.19,36.09 24.77,36.09 24.26,36.59 24.26,40.15 24.04,40.36 R4.2
N$6
  Top 0.254: R16.1 12.45,16.53 R17.1
N$7  (via drill 0.61)
  Top 0.254: IC1.1 20.96,34.94 v20.96,38.12 R5.1 R4.1 | D3.C 23.93,25.8 v24.13,25.8 24.33,26 D9.A | v10.03,40.4 R6.2
  Bottom 0.254: IC1.1 20.45,30.5 22.35,28.59 22.35,26.31 22.86,25.8 v24.13,25.8 | v20.96,38.12 20.96,37.1 20.19,36.34 11.05,36.34 10.03,37.36 v10.03,40.4
N$8
  Top 0.254: C5.1 26,28.94 D9.C D3.A
N$9
  Top 0.254: R8.2 5.33,34.56 IC1.7 5.21,30.88 6.73,29.35 9.52,29.35 10.29,28.59 IC1.10
N$10
  Top 0.254: R19.2 16.6,24.31 18.16,22.75 18.16,15.89 R17.3
N$11  (via drill 0.61)
  Top 0.254: R13.1 v8.89,20.85 | v19.18,21.73 19.05,21.7 R14.2 19.18,22.75 17.91,24.02 IC1.13
  Bottom 0.254: v8.89,20.85 18.8,20.85 19.18,21.23 v19.18,21.73
N$12
  Top 0.254: R11.2 3.34,21.86 | 3.34,21.86 C3.1 3.34,18.78 D1.A | 3.34,21.86 6.99,21.86 7.11,21.73 7.11,20.59 R13.2 7.15,18.78 D5.A
N$13  (via drill 0.61)
  Top 0.254: v5.21,15.89 D2.A D1.C
  Bottom 0.254: IC1.9 7.75,24.4 6.22,22.88 6.22,22.37 | 6.22,22.37 6.22,16.91 v5.21,15.89 | R64.2 29.46,25.29 26.8,22.75 18.8,22.75 17.4,21.35 10.29,21.35 9.4,22.24 6.35,22.24 6.22,22.37
N$14  (via drill 0.61)
  Top 0.254: C3.2 5.04,18.91 D2.C 5.08,17.92 5.59,17.42 8.25,17.42 8.64,17.8 v8.64,18.69 D6.C | R11.1 5.04,23.09 v5.08,23.13 | v14.86,19.83 R12.2
  Bottom 0.254: v5.08,23.13 5.08,21.01 C3.2 | 14.86,19.96 v14.86,19.83 14.35,20.34 9.91,20.34 8.76,19.19 8.76,18.31 v8.64,18.69
  other vias: 5.04,20.85
N$15
  Top 0.254: IC1.8 5.21,24.66 6.35,23.51 8.76,23.51 10.67,21.61 10.67,16.15 10.29,15.77 9.34,15.77 D6.A D5.C
N$16
  Top 0.254: R18.1 R12.1 14.99,21.7 14.99,26.43 IC1.12
N$17
  Top 0.254: IC1.14 20.45,23.26 21.34,22.37 R15.2 20.54,21.57 20.32,21.35 20.32,20.08 20.07,19.83 19.22,19.83 R14.1
N$18
  Top 0.254: R18.2 17.02,16.78 R17.2
N$19  (via drill 0.61)
  Top 0.254: IC2.2 50.16,36.34 50.42,36.59 51.69,36.59 v51.82,36.72 | v54.99,38.75 R9.2
  Bottom 0.254: v51.82,36.72 54.99,36.72 | 54.99,36.72 v54.99,38.75 | R20.3 58.04,35.58 57.02,36.72 54.99,36.72
N$20
  Top 0.254: C6.2 48.51,35.2 IC2.3 | R10.2 C6.2 | C6.2 C7.2
N$21
  Top 0.254: R21.2 52.83,41.17 53.09,41.42 56.77,41.42 60.07,38.12 | 60.07,38.12 R20.2 | C10.2 58.76,36.81 60.07,38.12
N$22
  Top 0.254: R23.2 40,41.29 40.39,41.67 43.18,41.67 | 43.18,41.67 43.18,39.01 43.43,38.75 44.16,38.75 R22.1 | 43.18,41.67 51.31,41.67 51.69,41.17 51.69,39.13 52.03,38.79 R21.1 52.83,34.43 IC2.1 52.7,30.62 54.48,28.85 56.84,28.85 D10.A D4.C
N$23
  Top 0.254: R22.2 C7.1
N$24
  Top 0.254: R23.1 R24.1 42.16,34.69 IC2.5
N$25
  Top 0.254: R25.2 37.72,34.56 IC2.7 37.46,31.01 39.37,29.1 41.53,29.1 42.54,28.08 IC2.10
N$26  (via drill 0.61)
  Top 0.254: 37.43,19.46 D13.A 37.3,19.41 C8.1 | R26.2 C8.1 | D11.A 41.02,20.21 40.77,20.46 39.62,20.46 39.41,20.68 R28.2 v39.37,21.48 | C8.1 v37.34,21.48
  Bottom 0.254: v37.34,21.48 v39.37,21.48
N$27  (via drill 0.61)
  Top 0.254: D11.C D12.A 39.3,16.4 38.73,16.4 38.35,16.78 38.35,24.27 40,25.93 IC2.9 | R35.2 56.64,25.29 53.47,28.47 50.55,28.47 v49.91,29.1
  Bottom 0.254: v49.91,29.1 48.89,28.08 48.89,25.16 48.64,24.91 42.16,24.91 41.02,26.05 40.64,26.05 IC2.9
N$28  (via drill 0.61)
  Top 0.254: D14.C 35.89,19.37 v35.56,19.32 | v39.37,19.32 39.17,19.32 D12.C | 35.73,19.54 D14.C | R26.1 C8.2 35.6,19.41 D14.C | R27.2 v47.12,20.46
  Bottom 0.254: v35.56,19.32 v39.37,19.32 D12.C 39.82,19.83 39.82,20.03 40.26,20.46 v47.12,20.46 47.12,20.21 46.86,20.46
N$29
  Top 0.254: D13.C D14.A 35.49,16.4 34.8,16.4 34.42,16.78 34.42,25.8 35.31,26.69 IC2.8
N$30  (via drill 0.61)
  Top 0.254: IC2.13 50.16,24.53 51.82,22.88 R29.2 | R28.1 41.11,22.84 v41.27,23.26
  Bottom 0.254: IC2.13 50.16,25.04 49.53,24.4 42.42,24.4 v41.27,23.26
N$31
  Top 0.254: IC2.12 47.62,23.77 47.12,23.26 R27.1 R32.1
N$32
  Top 0.254: IC2.14 52.7,24.27 53.97,23 R30.2 53.05,22.2 52.83,21.99 52.83,20.72 52.58,20.46 51.85,20.46 R29.1
N$33
  Top 0.254: D4.A D10.C 57.06,31.86 C10.1
N$34
  Top 0.254: R31.1 44.7,16.65 R33.1
N$35
  Top 0.254: R34.2 48.86,24.69 50.67,22.88 50.67,17.42 R31.3
N$36
  Top 0.254: R32.2 49.53,17.8 47.88,16.15 R31.2
N$37  (via drill 0.61)
  Top 0.254: IC3.2 83.19,35.58 R37.2 v83.44,37.99
  Bottom 0.254: v83.44,37.99 83.44,37.1 85.09,35.45 92.46,35.45 R39.3
N$38
  Top 0.254: R38.2 73.19,38.03 73.53,38.37 73.53,40.4 73.91,40.78 78.74,40.78 78.99,40.53 C11.2 79.03,39.77 79.76,39.77 80.01,39.51 80.01,38.12 | C12.2 80.1,38.03 80.01,38.12 | IC3.3 79.12,35.96 80.01,36.85 80.01,38.12
N$39
  Top 0.254: 92.84,37.61 R39.2 92.2,37.23 88.77,37.23 | R40.2 86.87,39.26 87.12,39.01 87.5,39.01 87.63,38.88 87.63,38.37 88.77,37.23 | C15.2 88.73,37.19 88.77,37.23
N$40  (via drill 0.61)
  Top 0.254: R40.1 R41.1 84.96,34.82 IC3.1 84.2,31.51 84.96,30.75 86.69,30.75 D24.A 86.74,29.35 87,29.1 D23.C | R42.2 75.02,39.73 v75.06,39.77
  Bottom 0.254: v75.06,39.77 75.44,39.77 75.69,39.51 75.69,36.97 76.71,35.96 82.3,35.96 IC3.1
N$41
  Top 0.254: R41.2 85.09,40.53 84.71,40.91 81.53,40.91 81.15,40.53 C12.1
N$42
  Top 0.254: IC3.5 74.68,34.69 R42.1 R43.1
N$43
  Top 0.254: R44.2 70.23,35.32 IC3.7 68.96,30.24 70.23,28.97 73.15,28.97 74.04,28.08 IC3.10
N$44  (via drill 0.61)
  Top 0.254: v67.69,19.45 67.77,19.5 D17.A 67.73,19.41 C13.1 R46.2 | 71.7,19.5 71.43,19.5 v71.37,19.45 71.37,18.56 71.88,18.05 79.25,18.05 81.03,19.83 R48.2
  Top 0.381: D19.A 71.7,19.5 v71.37,19.45
  Bottom 0.254: v67.69,19.45 v71.37,19.45
N$45
  Top 0.254: D17.C D18.A | IC3.9 71.5,28.08 71.12,28.47 68.07,28.47 65.91,26.31 65.91,17.04 66.55,16.4 67.49,16.4 D17.C | 68.27,16.4 D17.C
  Bottom 0.254: IC3.9 71.5,25.04 72.26,24.27 91.82,24.27 R36.2
N$46
  Top 0.254: R46.1 C13.2 | C13.2 69.43,19.54 D18.C | C13.2 R47.2 71.16,20.81 71.37,20.59 72.77,20.59 73.03,20.34 D20.C
N$47  (via drill 0.61)
  Top 0.254: D20.A D19.C 71.19,16.35 v71.37,16.53
  Bottom 0.254: v71.37,16.53 67.95,16.53 66.55,16.91 66.55,24.02 IC3.8
N$48
  Top 0.254: R49.2 83.1,21.23 82.3,21.23 82.04,21.48 82.04,22.5 81.7,22.84 R48.1 81.03,24.53 81.66,25.8 IC3.13
N$49  (via drill 0.61)
  Top 0.254: v72.77,21.61 72.64,21.65 R47.1 73.66,21.61 75.18,20.08 77.34,20.08 77.72,20.46 77.72,22.37 78.11,22.75 78.99,22.75 R52.1 79.12,22.97 IC3.12
  Bottom 0.254: v72.77,21.61 R47.1 72.9,21.57 72.9,19.7
N$50  (via drill 0.61)
  Top 0.254: v85.47,22.88 R50.2 85.51,22.88 v85.47,22.88 | R49.1 v83.06,22.88 | IC3.14 84.2,24.91 85.47,23.64 v85.47,22.88
  Bottom 0.254: v83.06,22.88 v85.47,22.88
N$51  (via drill 0.61)
  Top 0.254: D23.A 90.73,29.56 v90.68,29.1 | v86.74,33.55 D24.C 87.03,33.89 C15.1
  Bottom 0.254: v86.74,33.55 86.74,30.62 87.76,29.61 90.17,29.61 v90.68,29.1
N$52  (via drill 0.61)
  Top 0.254: v76.58,21.1 R53.1
  Bottom 0.254: v76.58,21.1 76.58,18.43 78.23,16.78 79.76,16.78 80.01,16.53 R51.1
N$53
  Top 0.254: R54.2 82.3,29.99 82.93,29.35 82.93,24.78 84.33,23.39 84.33,16.65 R51.3
N$54  (via drill 0.61)
  Top 0.254: v78.99,21.23 R52.2
  Bottom 0.254: R51.2 82.55,18.05 81.92,18.69 79.25,18.69 78.99,18.94 v78.99,21.23
N$55
  Top 0.254: D26.A Q3.3
  Top 0.813: JP2.2 41.66,45.94 D26.A
N$56
  Top 0.254: D27.A Q2.3
  Top 0.813: D27.A 26.98,47.72 JP3.2
N$57
  Top 0.254: 53.72,45.18 D25.A
  Top 0.381: D25.A Q1.3
  Top 0.813: JP1.2 53.72,46.12 53.59,45.99 53.59,45.05 D25.A
N$58
  Top 0.254: Q2.1 33.76,43.64 R58.1 R57.1
N$59
  Top 0.254: Q3.1 45.95,42.63 R59.1 R56.1
N$60
  Top 0.254: D21.A 66.09,44.29 66.55,43.83 Q4.3
  Top 0.813: D21.A 66.09,47.72 JP4.2
N$61  (via drill 0.61)
  Top 0.254: Q1.1 56.96,44.03 v57.28,44.09 | R60.1 60.24,43.83 v60.07,44.09 60.2,44.21 60.2,44.98 60.45,45.23 61.34,45.23 61.56,45.44 R55.1
  Bottom 0.254: v57.28,44.09 v60.07,44.09
N$62
  Top 0.254: 83.31,11.32 S1.2 82.3,11.85 82.3,12.59 82.08,12.81 R61.1
N$63
  Top 0.254: R62.1 82.66,7.6
  Top 0.381: 82.66,7.6 S2.2
N$64
  Top 0.254: R63.1 LED.C
N$65
  Top 0.254: R45.1 R65.1 70.83,42.9 69.72,41.8 65.79,41.8 65.66,41.67 65.66,40.76 Q4.1
N$66
  Top 0.254: D22.A 80.14,45.36 80.26,45.23 80.26,44.42 Q5.3
  Top 0.813: JP5.2 78.99,47.26 78.99,45.43 D22.A
N$67
  Top 0.254: R67.1 R66.1 79.14,41.8 Q5.1
N$68  (via drill 0.61)
  Top 0.254: U$1.1 91.69,44.47 v91.57,44.59
  Bottom 0.254: v91.57,44.59 93.22,44.59 93.85,45.23 96.14,45.23 96.9,44.47 Q7.1
N$69  (via drill 0.61)
  Top 0.254: U$1.2 v92.71,45.74
  Bottom 0.254: v92.71,45.74 96.39,45.74 Q7.2
N$72  (via drill 0.61)
  Top 0.254: U$1.3 90.93,47.01 v90.04,46.12
  Bottom 0.381: v90.04,46.12 90.04,40.02 BAT1.+1
PB0
  Top 0.254: ESP_ADAPTER2.5 95.76,11.45 98.3,8.91 101.35,8.91 101.98,9.54 101.98,10.16 XIO.34
PB1
  Top 0.254: XIO.33 100.6,10.19 100.71,10.3 100.71,13.73 100.46,13.99 97.66,13.99 95.63,16.02 91.82,16.02 90.55,14.75 90.55,12.84 ESP_ADAPTER2.6
PB2
  Bottom 0.254: XIO.32 101.96,13.63 101.6,13.99 ESP_ADAPTER2.7
PB3
  Top 0.254: XIO.31 96.51,12.73 96.14,13.1 96.14,14.5 95.12,15.51 93.6,15.51 ESP_ADAPTER2.8
PWM1
  Top 0.254: R57.2 35.27,48.62 35.56,48.91 48.64,48.91 50.55,50.82 51.18,50.82 PWML.8
PWM2
  Top 0.254: PWML.7 53.73,49.43 53.21,48.91 49.66,48.91 47.75,47.01 47.75,44.89 R56.2
PWM3
  Top 0.254: PWML.6 56.27,48.14 57.53,46.88 59.6,46.88 R55.2
PWM4
  Top 0.254: PWML.5 58.81,49.79 59.69,48.91 67.82,48.91 69.09,47.64 69.09,45.9 R45.2
PWM5  (via drill 0.61)
  Top 0.254: v73.79,48.4 74.8,47.39 74.8,42.18 75.18,41.8 R66.2
  Bottom 0.254: PWML.4 61.35,49.15 61.59,48.91 73.28,48.91 v73.79,48.4
RESET
  Top 0.254: S3.A2 37.94,12.81 37.21,12.08 37.21,3.85 POWER.3
RST
  Top 0.254: ESP_ADAPTER.4 80.3,11.19 R61.2
RX
  Top 0.381: COMMUNICATION.4 83.82,50.46 83.82,43.45 85.47,41.8 93.09,41.8 97.03,37.86 97.03,19.32 95.12,17.42 90.93,17.42 87.38,13.86 78.74,13.86 77.09,15.51 74.8,15.51 73.41,14.11 73.03,14.11 ESP_ADAPTER.1
SCL
  Top 0.254: JP7.2 98.3,44.47 97.92,44.85 96.14,44.85 95.76,45.23 95.76,46.75 94.78,47.73 R68.2 94.36,48.06 94.36,48.28 92.46,50.18 91.69,50.18 91.57,50.18 91.44,50.06 91.06,50.06 88.01,47.01 U$1.6
  Top 0.381: 91.69,50.18 91.69,50.72 COMMUNICATION.1
SDA  (via drill 0.61)
  Top 0.254: v97.28,42.05 97.41,41.84 R69.2 | v98.3,47.01 JP7.3 | U$1.5 88.52,48.28 89.41,49.17 89.41,50.69 COMMUNICATION.2
  Bottom 0.254: COMMUNICATION.2 89.41,50.69 89.41,48.15 90.17,47.39 97.41,47.39 97.79,47.01 v98.3,47.01 98.04,46.75 98.04,42.44 97.92,42.31 v97.28,42.05
SQW  (via drill 0.61)
  Top 0.254: U$1.7 v86.36,45.74
  Bottom 0.254: v86.36,45.74 86.36,37.74 87.76,36.34 93.73,36.34 96.77,39.39 103.76,39.39 104.27,39.9 JP7.1
TX
  Top 0.381: ESP_ADAPTER.8 78.87,6.11 79.25,6.49 79.25,8.53 80.39,9.67 84.84,9.67 86.36,11.19 86.36,12.59 86.87,13.1 88.14,13.23 91.57,16.65 95.38,16.65 97.79,19.07 97.79,38.12 93.47,42.44 85.85,42.44 84.58,43.71 84.58,48.53 86.23,50.18 86.23,50.33 COMMUNICATION.3
V+  (via drill 0.61)
  Top 0.254: IC2.4 45.09,31.77 46.1,30.75 v47.12,30.75 | v47.12,30.75 R34.1 47.16,30.79 v47.12,30.75 | v13.21,37.23 12.83,36.85 IC1.4 12.83,31.26 13.59,30.5 R19.1 | IC3.4 76.58,31.13 77.6,30.12 79.29,30.12 R54.1
  Bottom 0.254: v13.21,37.23 13.46,37.23 13.84,36.85 19.05,36.85 19.69,37.48 19.69,38.37 20.45,39.13 23.75,39.13 24.64,40.02 SJ1.2 27.94,40.02 28.7,39.26 33.4,39.26 36.2,36.47 43.56,36.47 45.09,34.94 IC2.4 | v47.12,30.75 47.12,30.88 48.26,32.53 64.26,32.53 67.82,36.09 75.69,36.09 76.58,35.2 IC3.4
V-  (via drill 0.61)
  Top 0.254: R16.2 12.45,26.43 IC1.11 | IC2.11 45.09,23.77 44.7,23.39 R33.2 | IC3.11 R53.2 | v18.29,29.1 21.08,29.1 22.86,27.32 28.07,27.32 28.45,26.94 34.29,26.94 36.2,28.85 37.34,28.85 v37.72,29.23
  Bottom 0.254: IC2.11 45.09,29.23 | IC3.11 76.45,26.56 76.45,28.34 75.82,28.97 51.56,28.97 50.42,30.12 47.88,30.12 46.99,29.23 45.09,29.23 | v18.29,29.1 18.03,28.85 13.46,28.85 12.83,28.21 IC1.11 | v37.72,29.23 45.09,29.23
VCC  (via drill 0.81)
  Top 0.813: IC5.IN 9.52,44.85 7.37,44.85 6.77,44.25 C17.+ 4.53,44.09 v4.45,44.09
  Bottom 0.254: 26.16,42.31 SJ1.3 26.04,42.31 10.16,42.31 9.65,42.82 IC5.IN
  Bottom 0.813: POWER.8 51.19,4.2 50.29,5.1 32.77,5.1 29.46,1.8 3.05,1.8 1.52,3.32 1.52,43.45 2.16,44.09 v4.45,44.09